# Altium schematic sheet Sheet_1.schdoc
size 265 x 111 mm
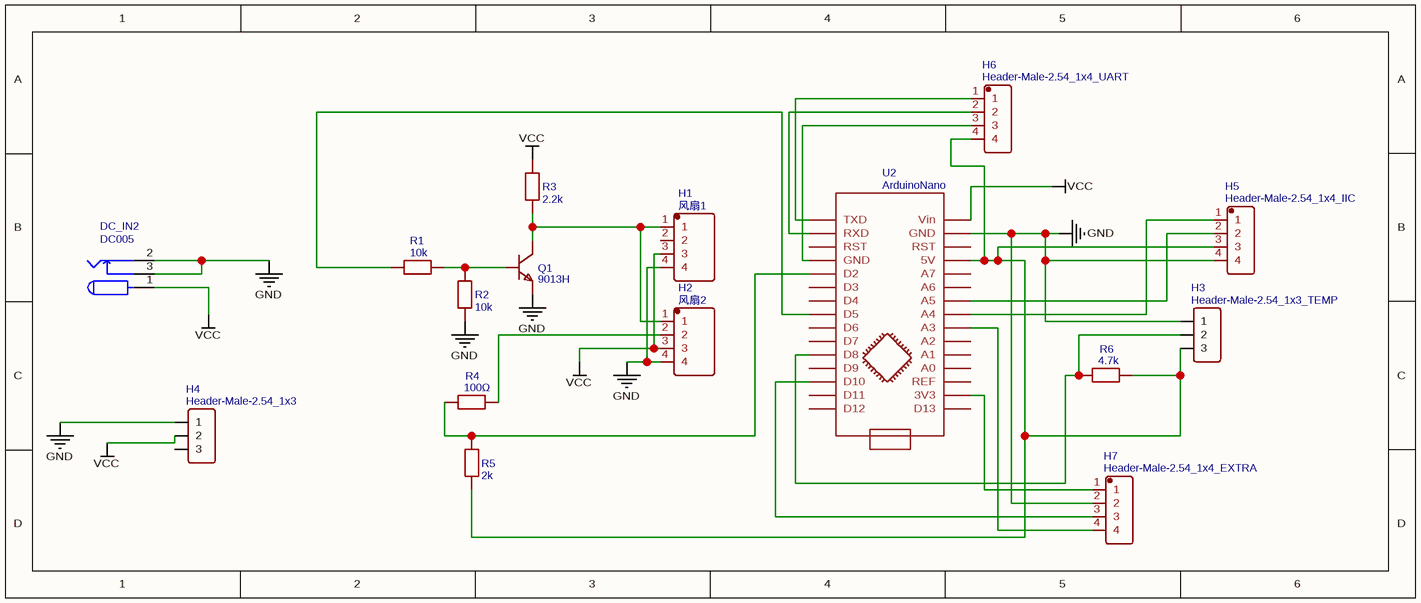
[diagram p0: Sheet_1.schdoc]

## Parts
DC_IN2  DC005  [DC005]
H1  风扇1  [DIP-1X4P-2.54MM-M]
H2  风扇2  [DIP-1X4P-2.54MM-M]
H3  Header-Male-2.54_1x3_TEMP  [HDR-TH_3P-P2.54-V]
H4  Header-Male-2.54_1x3  [HDR-TH_3P-P2.54-V]
H5  Header-Male-2.54_1x4_IIC  [HDR-TH_4P-P2.54-V]
H6  Header-Male-2.54_1x4_UART  [HDR-TH_4P-P2.54-V]
H7  Header-Male-2.54_1x4_EXTRA  [HDR-TH_4P-P2.54-V]
Q1  9013H  [TO-92(TO-92-3)]
R1  10k  [AXIAL-0.3]
R2  10k  [AXIAL-0.3]
R3  2.2k  [AXIAL-0.3]
R4  100Ω  [AXIAL-0.3]
R5  2k  [AXIAL-0.3]
R6  4.7k  [AXIAL-0.3]
U2  ArduinoNano  [ARDUINO NANO VINCENT]

## Nets
GND: DC_IN2.2 DC_IN2.3 H1.4 H2.4 H3.1 H4.1 H5.4 H7.2 Q1.1(E) R2.1 U2.29(GND)
VCC: DC_IN2.1 H1.3 H2.3 H4.2 R3.2 U2.30(Vin)
NetH1_1: H1.1 H2.1 Q1.3(C) R3.1
NetH2_2: H2.2 R4.2
NetH3_2: H3.2 R6.1 U2.11(D8)
NetH3_3: H3.3 H5.3 H6.4 R5.1 R6.2 U2.27(5V)
NetH5_1: H5.1 U2.23(A4)
NetH5_2: H5.2 U2.24(A5)
NetH6_1: H6.1 U2.1(TXD)
NetH6_2: H6.2 U2.2(RXD)
NetH6_3: H6.3 U2.4(GND)
NetH7_1: H7.1 U2.17(3V3)
NetH7_3: H7.3 U2.13(D10)
NetH7_4: H7.4 U2.22(A3)
NetQ1_2: Q1.2(B) R1.2 R2.2
NetR1_1: R1.1 U2.8(D5)
NetR4_1: R4.1 R5.2 U2.5(D2)

Not connected (* = marked no-connect by the designer): H1 2; H4 3; U2 3(RST) 6(D3) 7(D4) 9(D6) 10(D7) 12(D9) 14(D11) 15(D12) 16(D13) 18(REF) 19(A0) 20(A1) 21(A2) 25(A6) 26(A7) 28(RST)

## Library data of the parts
DC_IN2 = DC005: Contributor: nxnx; spicePre: D; spiceSymbolName: DC005
H1 = 风扇1: BOM_Manufacturer: Ckmtw; BOM_Manufacturer Part: 210S-1*4P L=11.6MMGold-plated black; Contributor: LCSC; BOM_Supplier: LCSC; BOM_Supplier Part: C124378; spicePre: H
H2 = 风扇2: BOM_Manufacturer: Ckmtw; BOM_Manufacturer Part: 210S-1*4P L=11.6MMGold-plated black; Contributor: LCSC; BOM_Supplier: LCSC; BOM_Supplier Part: C124378; spicePre: H
H3 = Header-Male-2.54_1x3_TEMP: BOM_Manufacturer: BOOMELE; BOM_Manufacturer Part: Header2.54mm 1*3P; BOM_Supplier: LCSC; image: //image.lceda.cn/szlcsc/C49257.jpg; BOM_Supplier Part: C49257; spicePre: H; spiceSymbolName: Header-Male-2.54_1x3
H4 = Header-Male-2.54_1x3: BOM_Manufacturer: BOOMELE; BOM_Manufacturer Part: Header2.54mm 1*3P; BOM_Supplier: LCSC; image: //image.lceda.cn/szlcsc/C49257.jpg; BOM_Supplier Part: C49257; spicePre: H; spiceSymbolName: Header-Male-2.54_1x3
H5 = Header-Male-2.54_1x4_IIC: BOM_Manufacturer: ReliaPro; BOM_Manufacturer Part: Headers  Pins 1*4P; BOM_Supplier: LCSC; image: http://image.lceda.cn/szlcsc/C59481.jpg; BOM_Supplier Part: C59481; spicePre: H; spiceSymbolName: Header-Male-2.54_1x4_C59481
H6 = Header-Male-2.54_1x4_UART: BOM_Manufacturer: ReliaPro; BOM_Manufacturer Part: Headers  Pins 1*4P; BOM_Supplier: LCSC; image: http://image.lceda.cn/szlcsc/C59481.jpg; BOM_Supplier Part: C59481; spicePre: H; spiceSymbolName: Header-Male-2.54_1x4_C59481
H7 = Header-Male-2.54_1x4_EXTRA: BOM_Manufacturer: ReliaPro; BOM_Manufacturer Part: Headers  Pins 1*4P; BOM_Supplier: LCSC; image: http://image.lceda.cn/szlcsc/C59481.jpg; BOM_Supplier Part: C59481; spicePre: H; spiceSymbolName: Header-Male-2.54_1x4_C59481
Q1 = 9013H: BOM_Manufacturer: SEMTECH; Contributor: LCSC; BOM_Supplier: LCSC; BOM_Manufacturer Part: 9013H; BOM_Supplier Part: C118553; spicePre: Q
R1 R2 = 10k: nameAlias: Value(Ω); spicePre: R; spiceSymbolName: Res_AXIAL-0.3(1/8W)_EU
R3 = 2.2k: nameAlias: Value(Ω); spicePre: R; spiceSymbolName: Res_AXIAL-0.3(1/8W)_EU
R4 = 100Ω: nameAlias: Value(Ω); spicePre: R; spiceSymbolName: Res_AXIAL-0.3(1/8W)_EU
R5 = 2k: nameAlias: Value(Ω); spicePre: R; spiceSymbolName: Res_AXIAL-0.3(1/8W)_EU
R6 = 4.7k: nameAlias: Value(Ω); spicePre: R; spiceSymbolName: Res_AXIAL-0.3(1/8W)_EU
U2 = ArduinoNano: Contributor: vincint810923; BOM_Manufacturer Part: ArduinoNano; spicePre: U; spiceSymbolName: ArduinoNano